# Altium schematic sheet Encoder.SchDoc
size A
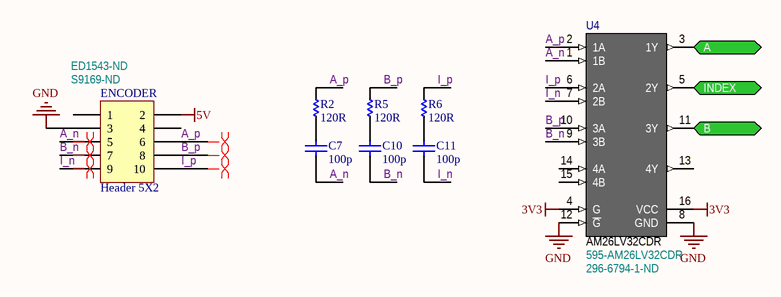
[diagram p0: Encoder.SchDoc]

## Parts
C7  100p  [CAPC1608N]
C10  100p  [CAPC1608N]
C11  100p  [CAPC1608N]
ENCODER  Header 5X2  Supplier Part Number 1: S9169-ND  Supplier Part Number 2: ED1543-ND  [HDR2X5_SHROUDED]
R2  120R  [RESC1608N]
R5  120R  [RESC1608N]
R6  120R  [RESC1608N]
U4  AM26LV32CDR  Supplier Part Number 1: 595-AM26LV32CDR  Supplier Part Number 2: 296-6794-1-ND  [SOIC127P600-16N]

## Ports
A (out), B (out), INDEX (out)

## Nets
3V3: U4.4(G) U4.16(VCC)
5V: ENCODER.2
GND: ENCODER.3 U4.8(GND) U4.12(~{G})
A: U4.3(1Y) ; port A
A_n: C7.1 ENCODER.5 U4.1(1B)
A_p: ENCODER.6 R2.2 U4.2(1A)
B: U4.11(3Y) ; port B
B_n: C10.1 ENCODER.7 U4.9(3B)
B_p: ENCODER.8 R5.2 U4.10(3A)
I_n: C11.1 ENCODER.9 U4.7(2B)
I_p: ENCODER.10 R6.2 U4.6(2A)
INDEX: U4.5(2Y) ; port INDEX
NetC7_2: C7.2 R2.1
NetC10_2: C10.2 R5.1
NetC11_2: C11.2 R6.1

Not connected (* = marked no-connect by the designer): ENCODER 1 4; U4 13(4Y) 14(4A) 15(4B)

## Layout directives
differential pair: A_n, A_p, B_n, B_p, I_n, I_p

## Library data of the parts
C7 C10 C11 = Cap Semi: Capacitor (Semiconductor SIM Model); Published: 8-Jun-2000; LatestRevisionDate: 29-May-2009; LatestRevisionNote: IPC-7351 Footprint Added.; PackageReference: C1206; Publisher: Altium Limited; PackageDescription: Chip Capacitor
ENCODER = Header 5X2: Header, 5-Pin, Dual row; LatestRevisionDate: 17-Jul-2002; LatestRevisionNote: Re-released for DXP Platform.; Publisher: Altium Limited; Supplier 1: Digi-Key; Supplier 2: Digi-Key
R2 R5 R6 = Res Semi: Semiconductor Resistor; Published: 8-Jun-2000; LatestRevisionDate: 17-Jul-2002; LatestRevisionNote: Re-released for DXP Platform.; PackageReference: AXIAL-0.5; Publisher: Altium Limited; PackageDescription: Axial Device, Thru-Hole; 2 Leads; 0.5 in Pin Spacing
U4 = AM26LV32CDR: Quad differential receiver; Supplier 1: Mouser; Supplier 2: Digi-Key